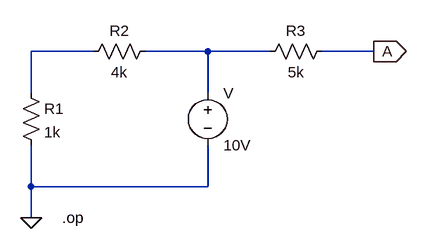
[diagram p0: schematic voltage_divider_6.asc]
voltage_divider_6.asc, the LTspice schematic file:
Version 4
SHEET 1 932 680
WIRE 240 144 144 144
WIRE 416 144 320 144
WIRE 512 144 416 144
WIRE 672 144 592 144
WIRE 144 208 144 144
WIRE 416 208 416 144
WIRE 144 352 144 288
WIRE 416 352 416 288
WIRE 416 352 144 352
WIRE 144 400 144 352
FLAG 144 400 0
FLAG 672 144 A
IOPIN 672 144 Out
SYMBOL voltage 416 192 R0
SYMATTR InstName V
SYMATTR Value 10V
SYMBOL Res 128 192 R0
SYMATTR InstName R1
SYMATTR Value 1k
SYMBOL Res 336 128 R90
WINDOW 0 0 56 VBottom 2
WINDOW 3 32 56 VTop 2
SYMATTR InstName R2
SYMATTR Value 4k
SYMBOL Res 608 128 R90
WINDOW 0 0 56 VBottom 2
WINDOW 3 32 56 VTop 2
SYMATTR InstName R3
SYMATTR Value 5k
TEXT 192 400 Left 2 !.op

The netlist it stands for:
* voltage_divider_6.asc
V N002 0 10V
R1 N001 0 1k
R2 N002 N001 4k
R3 A N002 5k
.op
.backanno
.end